# EAGLE schematic board2 (EAGLE 9.2.2)
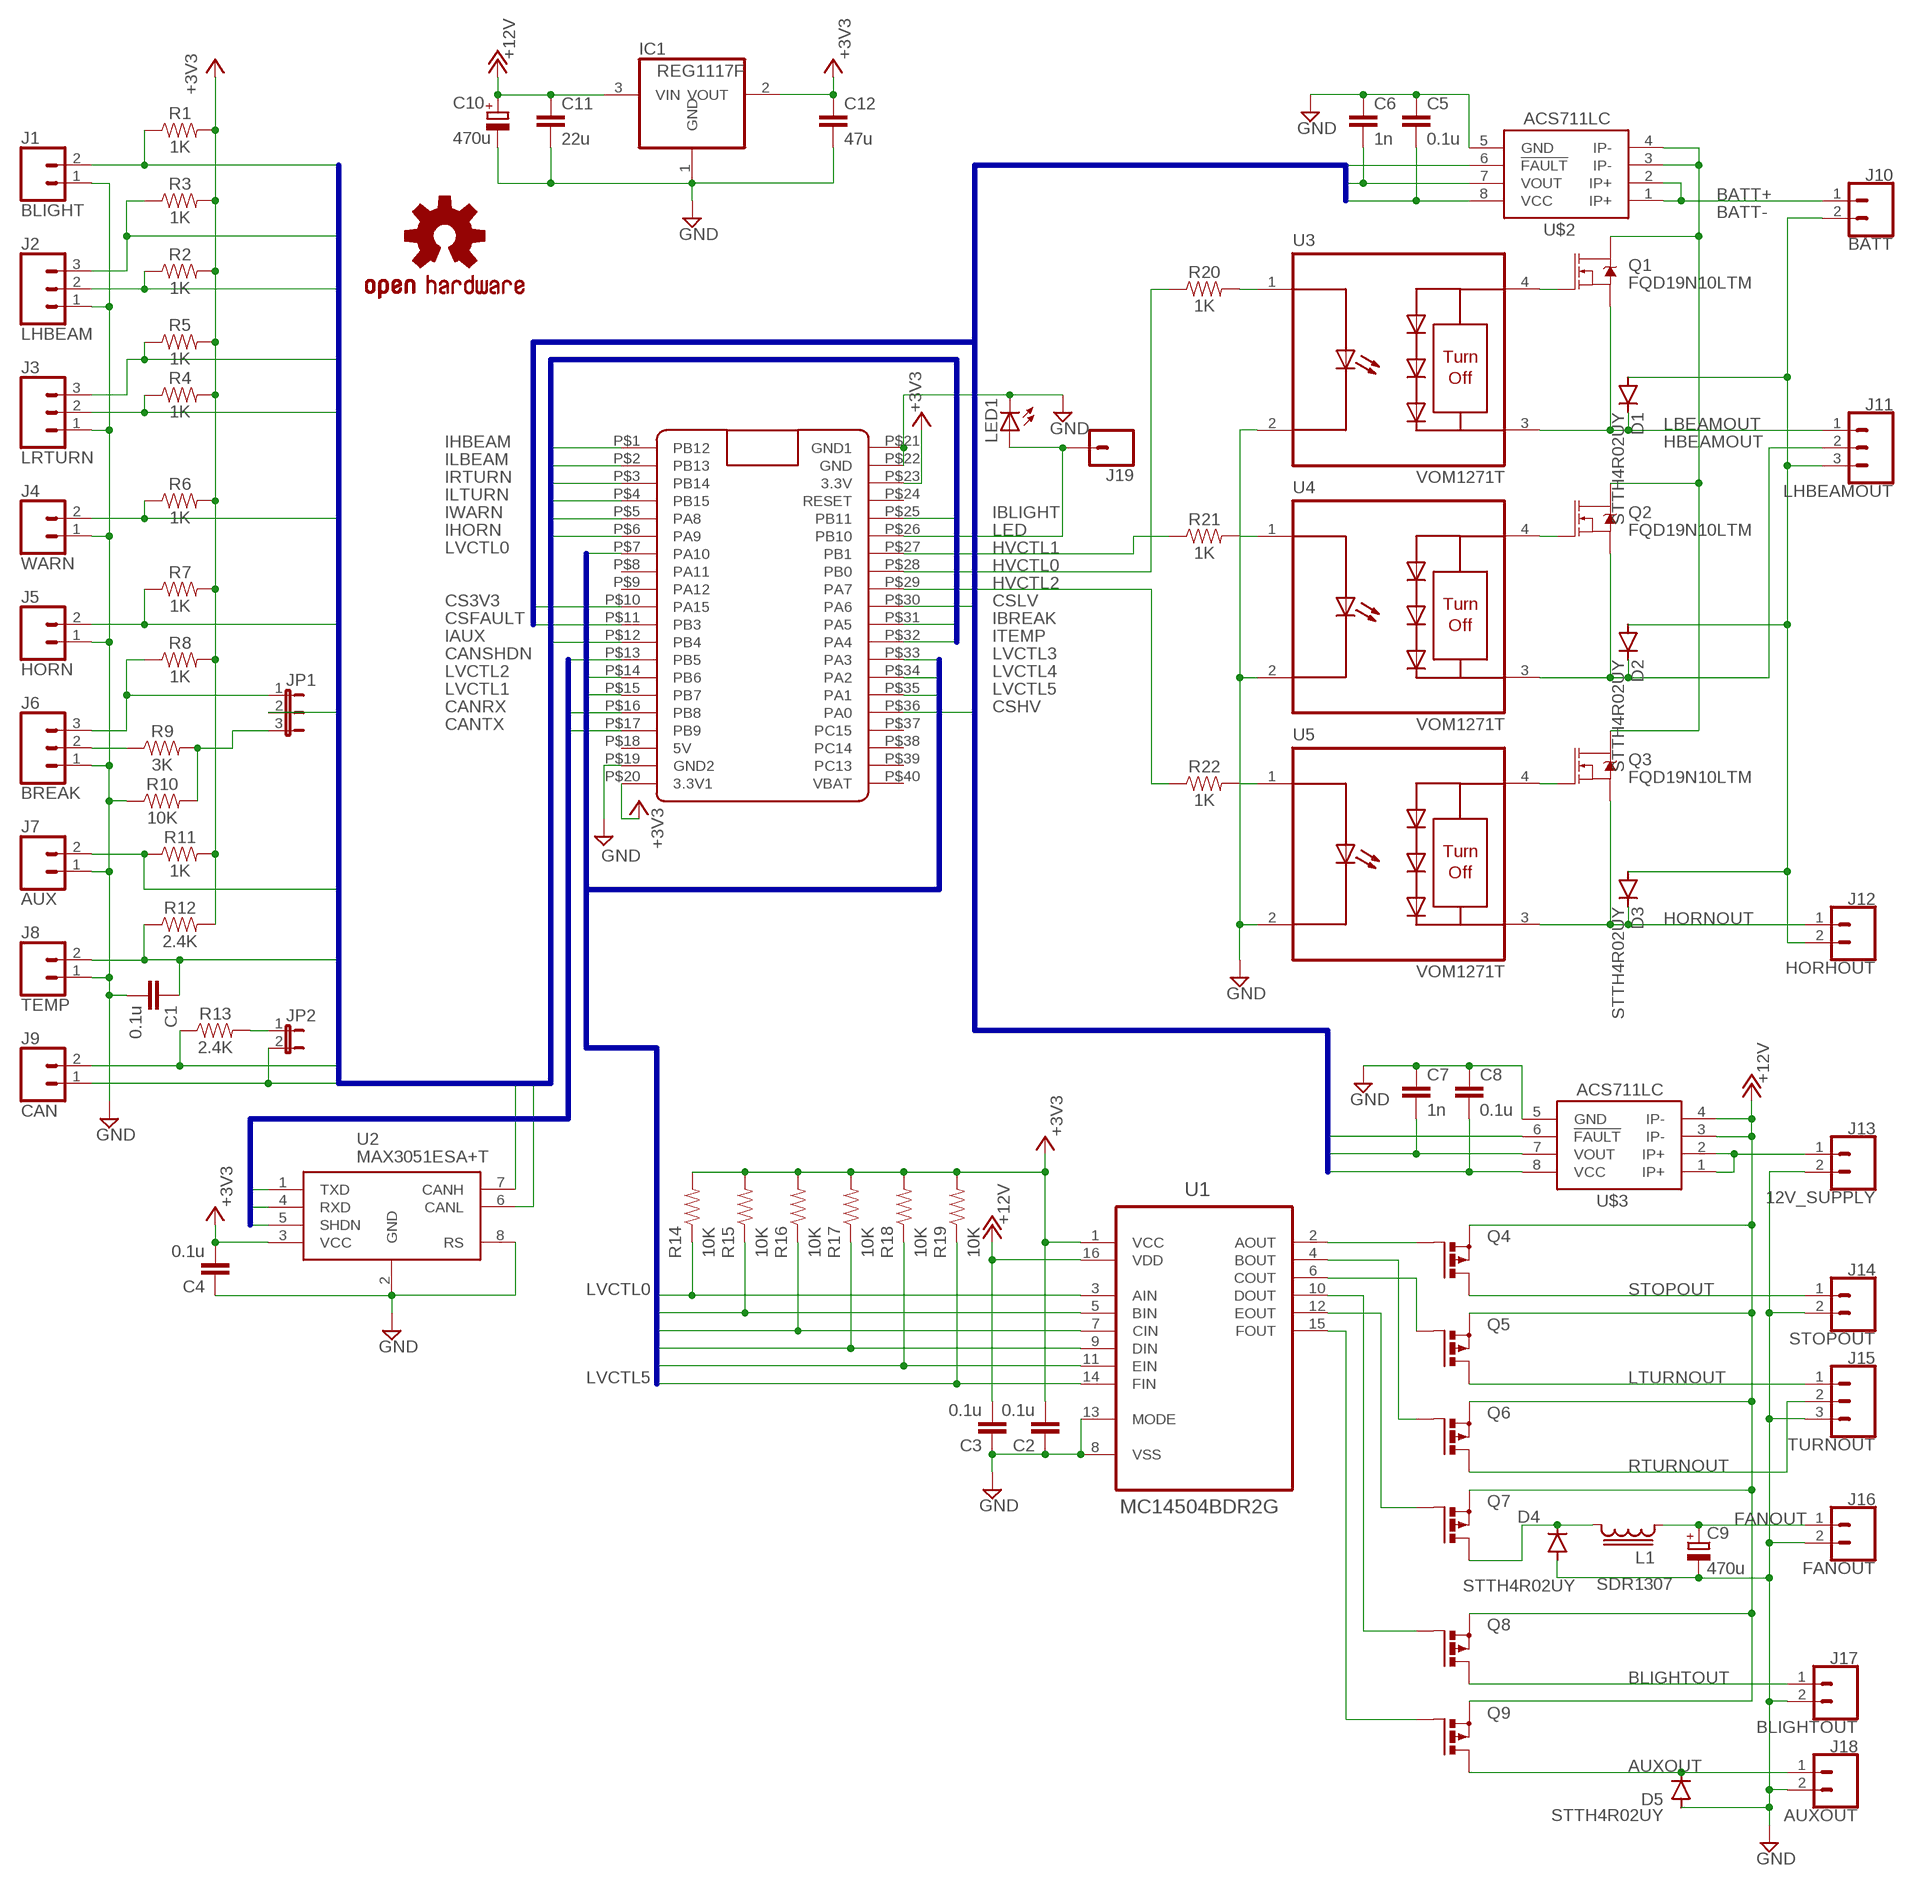
[diagram p0: schematic, sheet 1]

## Parts
C1  0.1u  C-EUC0805  [C0805]
C2  0.1u  C-EUC0805  [C0805]
C3  0.1u  C-EUC1206  [C1206]
C4  0.1u  C-EUC0805  [C0805]
C5  0.1u  C-EUC0805  [C0805]
C6  1n  C-EUC0805  [C0805]
C7  1n  C-EUC0805  [C0805]
C8  0.1u  C-EUC0805  [C0805]
C9  470u  CPOL-EUF  [PANASONIC_F]
C10  470u  CPOL-EUF  [PANASONIC_F]
C11  22u  C-EUC1206  [C1206]
C12  47u  C-EUC1206  [C1206]
D1  STTH4R02UY  DIODE-SMB  [SMB]
D2  STTH4R02UY  DIODE-SMB  [SMB]
D3  STTH4R02UY  DIODE-SMB  [SMB]
D4  STTH4R02UY  DIODE-SMB  [SMB]
D5  STTH4R02UY  DIODE-SMB  [SMB]
IC1  REG1117F  [DD-3]
J1  BLIGHT  CONN_023.5MM  [SCREWTERMINAL-3.5MM-2]
J2  LHBEAM  CONN_03SCREW  [SCREWTERMINAL-3.5MM-3]
J3  LRTURN  CONN_03SCREW  [SCREWTERMINAL-3.5MM-3]
J4  WARN  CONN_023.5MM  [SCREWTERMINAL-3.5MM-2]
J5  HORN  CONN_023.5MM  [SCREWTERMINAL-3.5MM-2]
J6  BREAK  CONN_03SCREW  [SCREWTERMINAL-3.5MM-3]
J7  AUX  CONN_023.5MM  [SCREWTERMINAL-3.5MM-2]
J8  TEMP  CONN_023.5MM  [SCREWTERMINAL-3.5MM-2]
J9  CAN  CONN_023.5MM  [SCREWTERMINAL-3.5MM-2]
J10  BATT  CONN_023.5MM  [SCREWTERMINAL-3.5MM-2]
J11  LHBEAMOUT  CONN_03SCREW  [SCREWTERMINAL-3.5MM-3]
J12  HORHOUT  CONN_023.5MM  [SCREWTERMINAL-3.5MM-2]
J13  12V_SUPPLY  CONN_023.5MM  [SCREWTERMINAL-3.5MM-2]
J14  STOPOUT  CONN_023.5MM  [SCREWTERMINAL-3.5MM-2]
J15  TURNOUT  CONN_03SCREW  [SCREWTERMINAL-3.5MM-3]
J16  FANOUT  CONN_023.5MM  [SCREWTERMINAL-3.5MM-2]
J17  BLIGHTOUT  CONN_023.5MM  [SCREWTERMINAL-3.5MM-2]
J18  AUXOUT  CONN_023.5MM  [SCREWTERMINAL-3.5MM-2]
J19  CONN_01  [1X01]
JP1  JP2E  [JP2]
JP2  JP1E  [JP1]
L1  SDR1307  [SDR1307]
LED1  LEDSML0805  [SML0805]
LOGO1  OSHW-LOGOL  [OSHW-LOGO-L]
Q1  FQD19N10LTM  MOSFET-NCH-FDD8780  [DPAK]
Q2  FQD19N10LTM  MOSFET-NCH-FDD8780  [DPAK]
Q3  FQD19N10LTM  MOSFET-NCH-FDD8780  [DPAK]
Q4  P-MOSFET-SO8  [SO-08]
Q5  P-MOSFET-SO8  [SO-08]
Q6  P-MOSFET-SO8  [SO-08]
Q7  P-MOSFET-SO8  [SO-08]
Q8  P-MOSFET-SO8  [SO-08]
Q9  P-MOSFET-SO8  [SO-08]
R1  1K  RESISTOR0603  [0603]
R2  1K  RESISTOR0603  [0603]
R3  1K  RESISTOR0603  [0603]
R4  1K  RESISTOR0603  [0603]
R5  1K  RESISTOR0603  [0603]
R6  1K  RESISTOR0603  [0603]
R7  1K  RESISTOR0603  [0603]
R8  1K  RESISTOR0603  [0603]
R9  3K  RESISTOR0603  [0603]
R10  10K  RESISTOR0603  [0603]
R11  1K  RESISTOR0603  [0603]
R12  2.4K  RESISTOR0603  [0603]
R13  2.4K  RESISTOR0603  [0603]
R14  10K  RESISTOR0603  [0603]
R15  10K  RESISTOR0603  [0603]
R16  10K  RESISTOR0603  [0603]
R17  10K  RESISTOR0603  [0603]
R18  10K  RESISTOR0603  [0603]
R19  10K  RESISTOR0603  [0603]
R20  1K  RESISTOR0603  [0603]
R21  1K  RESISTOR0603  [0603]
R22  1K  RESISTOR0603  [0603]
U1  MC14504BDR2G  [SOIC127P600X175-16N]
U2  MAX3051ESA+T  [SO-08]
U3  VOM1271T  [SOIC254P695X242-4N]
U4  VOM1271T  [SOIC254P695X242-4N]
U5  VOM1271T  [SOIC254P695X242-4N]
U$1  BLUE_PILL  [BLUE_PILL]
U$2  ACS711LC  ACS711  [SO08]
U$3  ACS711LC  ACS711  [SO08]

## Nets
12V_IN: J13.1 U$3.1(IP+) U$3.2(IP+)
+3V3: C2.2 C4.2 C12.1 IC1.2(VOUT) R1.2 R2.2 R3.2 R4.2 R5.2 R6.2 R7.2 R8.2 R11.2 R12.2 R14.2 R15.2 R16.2 R17.2 R18.2 R19.2 U1.1(VCC) U2.3(VCC) U$1.P$20(3.3V1) U$1.P$23(3.3V)
+12V: C3.2 C10.+ C11.1 IC1.3(VIN) Q4.1(S) Q4.2(S) Q4.3(S) Q5.1(S) Q5.2(S) Q5.3(S) Q6.1(S) Q6.2(S) Q6.3(S) Q7.1(S) Q7.2(S) Q7.3(S) Q8.1(S) Q8.2(S) Q8.3(S) Q9.1(S) Q9.2(S) Q9.3(S) U1.16(VDD) U$3.3(IP-) U$3.4(IP-)
AUXOUT: D5.C J18.1 Q9.5(D) Q9.6(D) Q9.7(D) Q9.8(D)
BATT+: J10.1 U$2.1(IP+) U$2.2(IP+)
BATT-: D1.A D2.A D3.A J10.2 J11.3 J12.2
BLIGHTOUT: J17.1 Q8.5(D) Q8.6(D) Q8.7(D) Q8.8(D)
CANH: J9.1 JP2.2 U2.7(CANH)
CANL: J9.2 R13.1 U2.6(CANL)
CANRX: U2.4(RXD) U$1.P$16(PB8)
CANSHDN: U2.5(SHDN) U$1.P$13(PB5)
CANTX: U2.1(TXD) U$1.P$17(PB9)
CS3V3: C5.2 C8.2 U$1.P$10(PA15) U$2.8(VCC) U$3.8(VCC)
CSFAULT: U$1.P$11(PB3) U$2.6(!FAULT) U$3.6(!FAULT)
CSHV: C6.2 U$1.P$36(PA0) U$2.7(VOUT)
CSLV: C7.2 U$1.P$30(PA6) U$3.7(VOUT)
FANOUT: C9.+ J16.1 L1.1
GND: C1.2 C2.1 C3.1 C4.1 C5.1 C6.1 C7.1 C8.1 C9.- C10.- C11.2 C12.2 D4.A D5.A IC1.1(GND) J1.1 J2.1 J3.1 J4.1 J5.1 J6.1 J7.1 J8.1 J13.2 J14.2 J15.3 J16.2 J17.2 J18.2 LED1.C R10.1 U1.8(VSS) U1.13(MODE) U2.2(GND) U2.8(RS) U3.2(C1) U4.2(C1) U5.2(C1) U$1.P$19(GND2) U$1.P$21(GND1) U$1.P$22(GND) U$2.5(GND) U$3.5(GND)
HBEAMOUT: D2.C J11.2 Q2.3(S) U4.3(C2)
HORNOUT: D3.C J12.1 Q3.3(S) U5.3(C2)
HVCTL0: R20.1 U$1.P$28(PB0)
HVCTL1: R21.1 U$1.P$27(PB1)
HVCTL2: R22.1 U$1.P$29(PA7)
IAUX: J7.2 R11.1 U$1.P$12(PB4)
IBLIGHT: J1.2 R1.1 U$1.P$25(PB11)
IBREAK: JP1.2 U$1.P$31(PA5)
IHBEAM: J2.2 R2.1 U$1.P$1(PB12)
IHORN: J5.2 R7.1 U$1.P$6(PA9)
ILBEAM: J2.3 R3.1 U$1.P$2(PB13)
ILTURN: J3.3 R5.1 U$1.P$4(PB15)
IRTURN: J3.2 R4.1 U$1.P$3(PB14)
ITEMP: C1.1 J8.2 R12.1 U$1.P$32(PA4)
IWARN: J4.2 R6.1 U$1.P$5(PA8)
LBEAMOUT: D1.C J11.1 Q1.3(S) U3.3(C2)
LED: J19.1 LED1.A U$1.P$26(PB10)
LTURNOUT: J15.1 Q5.5(D) Q5.6(D) Q5.7(D) Q5.8(D)
LVCTL0: R14.1 U1.3(AIN) U$1.P$7(PA10)
LVCTL1: R15.1 U1.5(BIN) U$1.P$15(PB7)
LVCTL2: R16.1 U1.7(CIN) U$1.P$14(PB6)
LVCTL3: R17.1 U1.9(DIN) U$1.P$33(PA3)
LVCTL4: R18.1 U1.11(EIN) U$1.P$34(PA2)
LVCTL5: R19.1 U1.14(FIN) U$1.P$35(PA1)
LVG0: Q4.4(G) U1.2(AOUT)
LVG1: Q6.4(G) U1.4(BOUT)
LVG2: Q5.4(G) U1.6(COUT)
LVG3: Q8.4(G) U1.10(DOUT)
LVG4: Q7.4(G) U1.12(EOUT)
LVG5: Q9.4(G) U1.15(FOUT)
N$1: J6.3 JP1.1 R8.1
N$2: JP2.1 R13.2
N$3: JP1.3 R9.2 R10.2
N$4: J6.2 R9.1
N$5: Q1.4(D) Q2.4(D) Q3.4(D) U$2.3(IP-) U$2.4(IP-)
N$6: D4.C L1.2 Q7.5(D) Q7.6(D) Q7.7(D) Q7.8(D)
N$9: R20.2 U3.1(A1)
N$10: Q1.1(G) U3.4(A2)
N$11: R21.2 U4.1(A1)
N$12: Q2.1(G) U4.4(A2)
N$13: R22.2 U5.1(A1)
N$14: Q3.1(G) U5.4(A2)
RTURNOUT: J15.2 Q6.5(D) Q6.6(D) Q6.7(D) Q6.8(D)
STOPOUT: J14.1 Q4.5(D) Q4.6(D) Q4.7(D) Q4.8(D)
Unconnected: U$1.P$8(PA11) U$1.P$9(PA12) U$1.P$18(5V) U$1.P$24(RESET) U$1.P$37(PC15) U$1.P$38(PC14) U$1.P$39(PC13) U$1.P$40(VBAT)

## Buses
INPUTS:CANH,CANL,IAUX,IBLIGHT,IBREAK,IHBEAM,IHORN,ILBEAM,ILTURN,IRTURN,ITEMP,IWARN
LVCTL:LVCTL[0..5]
CAN:CANRX,CANSHDN,CANTX
CS:CS3V3,CSFAULT,CSHV,CSLV

## Library data of the parts
C1-C8 C11 C12 = rcl:C-EU: CAPACITOR, European symbol; SPICEPREFIX: C
C9 C10 = rcl:CPOL-EU: POLARIZED CAPACITOR, European symbol; SPICEPREFIX: C
D1-D5 = diode:DIODE-: DIODE
IC1 = burr-brown:REG1117: 800mA and 1A Low Dropout (LDO) Positive Regulator 1.8V, 2.5V, 2.85V, 3.3V, 5V, and Adj; MF: TEXAS INSTRUMENTS; MPN: REG1117FAKTTT; OC_FARNELL: 1296120; OC_NEWARK: 87H2562
J1 J4 J5 J7-J10 J12-J14 J16-J18 = SparkFun-Connectors:CONN_02: Multi connection point. Often used as Generic Header-pin footprint for 0.1 inch spaced/style header connections On any of the 0.1 inch spaced packages, you can populate with these: Break Away Headers - Straight <https://www.sparkfun.com/products/116> (PRT-00116) Break Away Male Headers - Right Angle <https://www.sparkfun.com/products/553> (PRT-00553) Female Headers <https://www.sparkfun.com/products/115> (PRT-00115) Break Away Headers - Machine Pin <https://www.sparkfun.com/products/117> (PRT-00117) Break Away Female Headers - Swiss Machine Pin <https://www.sparkfun.com/products/743> (PRT-00743) For SCREWTERMINALS and SPRING TERMINALS visit here: Screw Terimnals on SparkFun.com <https://www.sparkfun.com/search/results?term=Screw+Terminals> (5mm/3.5mm/2.54mm spacing) This device is also useful as a general connection point to wire up your design to another part of your project. Our various solder wires solder well into these plated through hole pads. Hook-Up Wire - Assortment (Stranded, 22 AWG) <https://www.sparkfun.com/products/11375> (PRT-11375) Hook-Up Wire - Assortment (Solid Core, 22 AWG) <https://www.sparkfun.com/products/11367> (PRT-11367) View the entire wire category on our website here <https://www.sparkfun.com/categories/141> Special notes: Molex polarized connector foot print use with: PRT-08233 with associated crimp pins and housings. 2.54_SCREWTERM for use with PRT-10571. 3.5mm Screw Terminal footprints for PRT-08084 5mm Screw Terminal footprints for use with PRT-08432; PROD_ID: CONN-08399
J2 J3 J6 J11 J15 = SparkFun-Connectors:CONN_03: Multi connection point. Often used as Generic Header-pin footprint for 0.1 inch spaced/style header connections On any of the 0.1 inch spaced packages, you can populate with these: Break Away Headers - Straight <https://www.sparkfun.com/products/116> (PRT-00116) Break Away Male Headers - Right Angle <https://www.sparkfun.com/products/553> (PRT-00553) Female Headers <https://www.sparkfun.com/products/115> (PRT-00115) Break Away Headers - Machine Pin <https://www.sparkfun.com/products/117> (PRT-00117) Break Away Female Headers - Swiss Machine Pin <https://www.sparkfun.com/products/743> (PRT-00743) Stackable Header - 3 Pin (Female, 0.1") <https://www.sparkfun.com/products/13875> (PRT-13875) For SCREWTERMINALS and SPRING TERMINALS visit here: Screw Terimnals on SparkFun.com <https://www.sparkfun.com/search/results?term=Screw+Terminals> (5mm/3.5mm/2.54mm spacing) This device is also useful as a general connection point to wire up your design to another part of your project. Our various solder wires solder well into these plated through hole pads. Hook-Up Wire - Assortment (Stranded, 22 AWG) <https://www.sparkfun.com/products/11375> (PRT-11375) Hook-Up Wire - Assortment (Solid Core, 22 AWG) <https://www.sparkfun.com/products/11367> (PRT-11367) View the entire wire category on our website here <https://www.sparkfun.com/categories/141> Special notes: Molex polarized connector foot print use with SKU : PRT-08232 with associated crimp pins and housings.; PROD_ID: CONN-08288; SF_ID: PRT-08235
J19 = SparkFun-Connectors:CONN_01: Single connection point. Often used as Generic Header-pin footprint for 0.1 inch spaced/style header connections On any of the 0.1 inch spaced packages, you can populate with these: Break Away Headers - Straight <https://www.sparkfun.com/products/116> (PRT-00116) Break Away Male Headers - Right Angle <https://www.sparkfun.com/products/553> (PRT-00553) Female Headers <https://www.sparkfun.com/products/115> (PRT-00115) Break Away Headers - Machine Pin <https://www.sparkfun.com/products/117> (PRT-00117) Break Away Female Headers - Swiss Machine Pin <https://www.sparkfun.com/products/743> (PRT-00743) This device is also useful as a general connection point to wire up your design to another part of your project. Our various solder wires solder well into these plated through hole pads. Hook-Up Wire - Assortment (Stranded, 22 AWG) <https://www.sparkfun.com/products/11375> (PRT-11375) Hook-Up Wire - Assortment (Solid Core, 22 AWG) <https://www.sparkfun.com/products/11367> (PRT-11367) View the entire wire category on our website here <https://www.sparkfun.com/categories/141> Special notes: SMTSO-256-ET is a "flush mount" nut for a 4-40 screw. We mostly use this on specialty testbeds; it is a nice way to connect hardware to your PCB at an adjustable hieght. Also note, the SNAP packages are for using a snappable style connector. We sell a baggie of snaps and they are also used on two LilyPad designs: Snap Assortment - 30 pack (male and female) <https://www.sparkfun.com/products/11347> (DEV-11347) LilyPad Arduino SimpleSnap <https://www.sparkfun.com/products/10941> (DEV-10941) LilyPad SimpleSnap Protoboard <https://www.sparkfun.com/products/10940> (DEV-10940)
JP1 = jumper:JP2E: JUMPER
JP2 = jumper:JP1E: JUMPER
L1 = inductor-bourns:SDR1307: POWER INDUCTOR
LED1 = led:LED: LED OSRAM: - CHIPLED LG R971, LG N971, LY N971, LG Q971, LY Q971, LO R971, LY R971 LH N974, LH R974 LS Q976, LO Q976, LY Q976 LO Q996 - Hyper CHIPLED LW Q18S LB Q993, LB Q99A, LB R99A - SideLED LS A670, LO A670, LY A670, LG A670, LP A670 LB A673, LV A673, LT A673, LW A673 LH A674 LY A675 LS A676, LA A676, LO A676, LY A676, LW A676 LS A679, LY A679, LG A679 - Hyper Micro SIDELED® LS Y876, LA Y876, LO Y876, LY Y876 LT Y87S - SmartLED LW L88C, LW L88S LB L89C, LB L89S, LG L890 LS L89K, LO L89K, LY L89K LS L896, LA L896, LO L896, LY L896 - TOPLED LS T670, LO T670, LY T670, LG T670, LP T670 LSG T670, LSP T670, LSY T670, LOP T670, LYG T670 LG T671, LOG T671, LSG T671 LB T673, LV T673, LT T673, LW T673 LH T674 LS T676, LA T676, LO T676, LY T676, LB T676, LH T676, LSB T676, LW T676 LB T67C, LV T67C, LT T67C, LS T67K, LO T67K, LY T67K, LW E67C LS E67B, LA E67B, LO E67B, LY E67B, LB E67C, LV E67C, LT E67C LW T67C LS T679, LY T679, LG T679 LS T770, LO T770, LY T770, LG T770, LP T770 LB T773, LV T773, LT T773, LW T773 LH T774 LS E675, LA E675, LY E675, LS T675 LS T776, LA T776, LO T776, LY T776, LB T776 LHGB T686 LT T68C, LB T68C - Hyper Mini TOPLED® LB M676 - Mini TOPLED Santana® LG M470 LS M47K, LO M47K, LY M47K Source: http://www.osram.convergy.de LUXEON: - LUMILED® LXK2-PW12-R00, LXK2-PW12-S00, LXK2-PW14-U00, LXK2-PW14-V00 LXK2-PM12-R00, LXK2-PM12-S00, LXK2-PM14-U00 LXK2-PE12-Q00, LXK2-PE12-R00, LXK2-PE12-S00, LXK2-PE14-T00, LXK2-PE14-U00 LXK2-PB12-K00, LXK2-PB12-L00, LXK2-PB12-M00, LXK2-PB14-N00, LXK2-PB14-P00, LXK2-PB14-Q00 LXK2-PR12-L00, LXK2-PR12-M00, LXK2-PR14-Q00, LXK2-PR14-R00 LXK2-PD12-Q00, LXK2-PD12-R00, LXK2-PD12-S00 LXK2-PH12-R00, LXK2-PH12-S00 LXK2-PL12-P00, LXK2-PL12-Q00, LXK2-PL12-R00 Source: www.luxeon.com KINGBRIGHT: KA-3528ASYC Source: www.kingbright.com
LOGO1 = SparkFun-Aesthetics:OSHW-LOGO: Open-Source Hardware (OSHW) Logo This logo indicates the piece of hardware it is found on incorporates a OSHW license and/or adheres to the definition of open source hardware found here: http://freedomdefined.org/OSHW
Q1-Q3 = SparkFun-DiscreteSemi:MOSFET-NCH: N-channel MOSFETs Voltage controlled devices that allow control of high current outputs. SparkFun Products: SparkFun OpenScale <https://www.sparkfun.com/products/13261> SparkFun Digital Sandbox <https://www.sparkfun.com/products/12651> SparkFun Monster Moto Shield <https://www.sparkfun.com/products/10182> SparkFun MOSFET Power Controller <https://www.sparkfun.com/products/11214>; PROD_ID: TRANS-09984; VALUE: 35A/25V/8.5mΩ
Q4-Q9 = transistor-power:P-MOSFET-SO8: P-Channel MOSFET Example: FDS4435A; P-Channel Logic Level PowerTrench® MOSFET FDS4465; P-Channel 1.8V Specified PowerTrench® MOSFET Source: www.fairchildsemi.com
R1-R22 = SparkFun-Resistors:RESISTOR: Generic Resistor Package
U1 = MC14504BDR2G:MC14504BDR2G: Hex Level Shifter for TTL to CMOS or CMOS to CMOS; AVAILABILITY: Unavailable; DESCRIPTION: MC14504B Series SMT Hex Level Shifter for TTL to CMOS/CMOS to CMOS - SOIC-16; MF: ON Semiconductor; MP: MC14504BDR2G; PACKAGE: SOIC-16 ON Semiconductor; PRICE: None
U2 = MAX3051ESA:MAX3051ESA: Can bus transciever Datasheet: http://datasheets.maximintegrated.com/en/ds/MAX3051.pdf
U3-U5 = VOM1271T:VOM1271T; AVAILABILITY: Good; DESCRIPTION: Relay SSR 50mA 1.6V DC-IN 4-Pin SOP T/R; MF: Vishay Semiconductor; MP: VOM1271T; PACKAGE: SOP-4 Vishay; PRICE: 1.60 USD
U$1 = BluePill:BLUE_PILL
U$2 U$3 = svetozar:ACS711: ACS711LC Hall-effect-based isolated linear current sensor Datasheet <http://www.allegromicro.com/~/media/Files/Datasheets/ACS711-Datasheet.ashx?la=en>; PROD_ID: IC-08964